# EAGLE design TPT02rr (EAGLE 7.5.0)
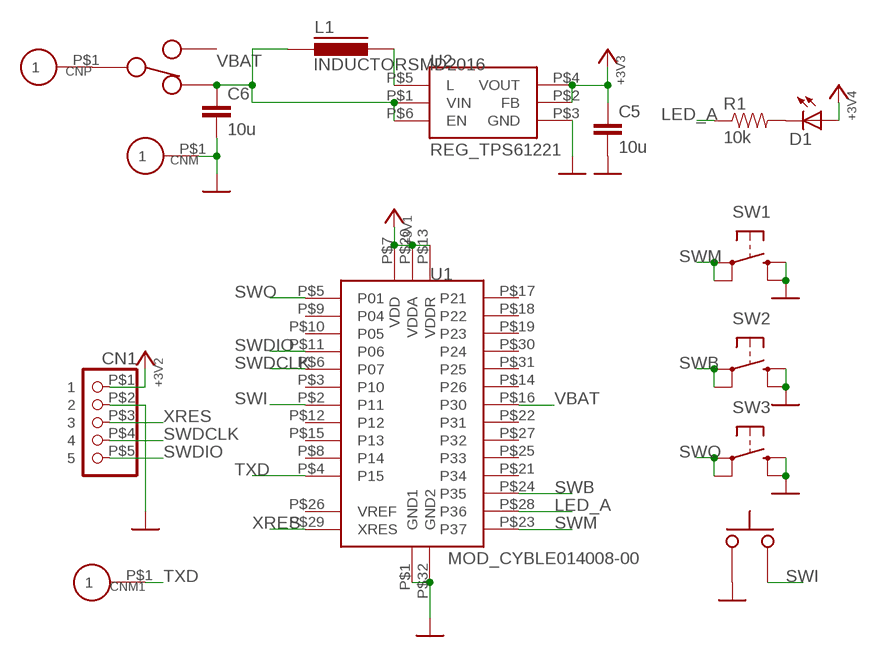
[diagram p0: schematic, sheet 1]

## Parts
C5  10u  CAP0603  [0603]
C6  10u  CAP0603  [0603]
CN1  CON_PINHD-1X550MIL  [1X5_50MIL]
CNM  CON_P01SMD1MM  [PAD_SMD1MM]
CNM1  CON_P01SMD1MM  [PAD_SMD1MM]
CNP  CON_P01SMD1MM  [PAD_SMD1MM]
D1  LED0603  [SPARKFUN_LED-0603]
L1  INDUCTORSMD2016  [2016]
R1  10k  RES0603  [0603]
SW1  SW_TACTEVQP2  [SW_EVQP2]
SW2  SW_TACTEVQPLBA08  [SW_EVQPLBA08]
SW3  SW_TACTEVQPLBA08  [SW_EVQPLBA08]
SW4  SW_SLIDECUS12B  [SW_CUS-12B]
SW5  SW_TACT2PB3U3000  [SW_B3U-3000P]
U1  MOD_CYBLE014008-00  [MOD_CYBLE014008-00]
U2  REG_TPS61221  [SC70-6]

## Nets
+3V3: C5.1 CN1.P$1 D1.A U1.P$7(VDD) U1.P$13(VDDR) U1.P$20(VDDA) U2.P$2(FB) U2.P$4(VOUT) ; supply symbol labelled POW_+3V3
GND: C5.2 C6.2 CN1.P$2 CNM.P$1 SW1.PB1(S) SW1.PB2(S1) SW2.B1(S) SW2.B2(S1) SW3.B1(S) SW3.B2(S1) SW5.P$2 U1.P$1(GND1) U1.P$32(GND2) U2.P$3(GND) ; supply symbol labelled POW_GND
LED_A: R1.1 U1.P$28(P36)
N$2: L1.P$2 U2.P$5(L)
N$7: D1.C R1.2
N$8: CNP.P$1 SW4.P$2
SWB: SW2.A1(P) SW2.A2(P1) U1.P$24(P35)
SWDCLK: CN1.P$4 U1.P$6(P07)
SWDIO: CN1.P$5 U1.P$11(P06)
SWI: SW5.P$1 U1.P$2(P11)
SWM: SW1.PA1(P) SW1.PA2(P1) U1.P$23(P37)
SWO: SW3.A1(P) SW3.A2(P1) U1.P$5(P01)
TXD: CNM1.P$1 U1.P$4(P15)
VBAT: C6.1 L1.P$1 SW4.P$1 U1.P$16(P30) U2.P$1(VIN) U2.P$6(EN)
XRES: CN1.P$3 U1.P$29(XRES)
Unconnected: U1.P$3(P10) U1.P$8(P14) U1.P$9(P04) U1.P$10(P05) U1.P$12(P12) U1.P$14(P26) U1.P$15(P13) U1.P$17(P21) U1.P$18(P22) U1.P$19(P23) U1.P$21(P34) U1.P$22(P31) U1.P$25(P33) U1.P$26(VREF) U1.P$27(P32) U1.P$30(P24) U1.P$31(P25)

## Power pins joined to a net without a drawn wire
P$3: SW4.P$3

## Library data of the parts
C5 C6 = akita:CAP: Capacitor Standard 0603 ceramic capacitor, and 0.1" leaded capacitor.
CN1 = akita:CON_PINHD-1X5: PIN HEADER
CNM CNM1 CNP = akita:CON_P01
D1 = akita:LED: LEDs Standard schematic elements and footprints for 5mm, 3mm, 1206, and 0603 sized LEDs. 5mm - Spark Fun Electronics SKU : COM-00529 (and others)
L1 = akita:INDUCTOR: Inductor
R1 = akita:RES: Resistor Basic schematic elements and footprints for 0603, 1206, and PTH resistors.
SW1-SW3 = akita:SW_TACT: OMRON SWITCH
SW4 = akita:SW_SLIDE
SW5 = akita:SW_TACT2P: OMRON SWITCH
U1 = akita:MOD_CYBLE014008-00: Cypress CYBLE014008-000
U2 = akita:REG_TPS61221: TI's TPS61220/1/2, boost DC/DC

## Board
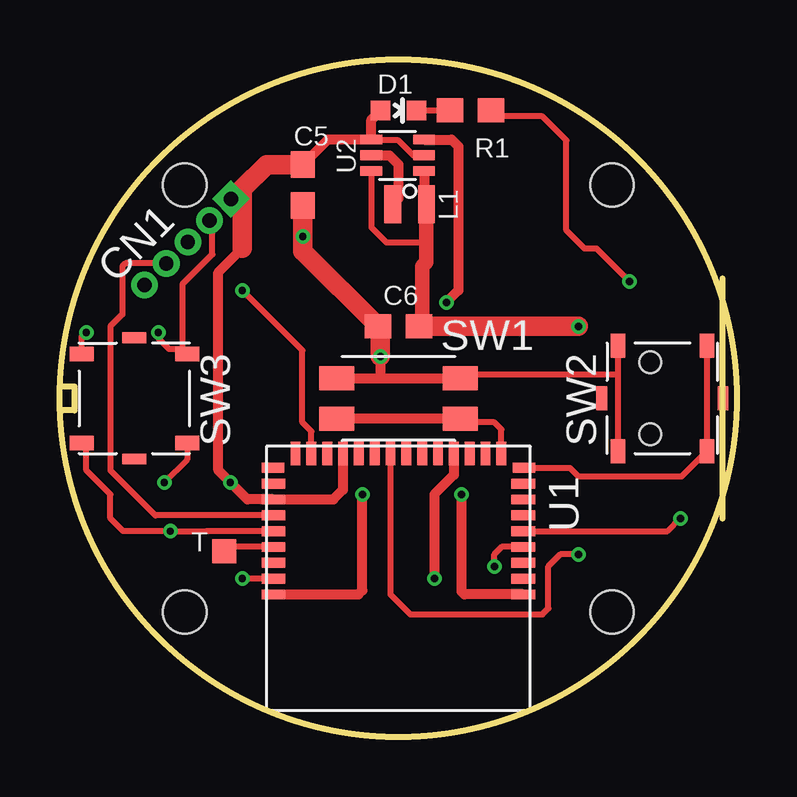
[diagram p1: board, top side]
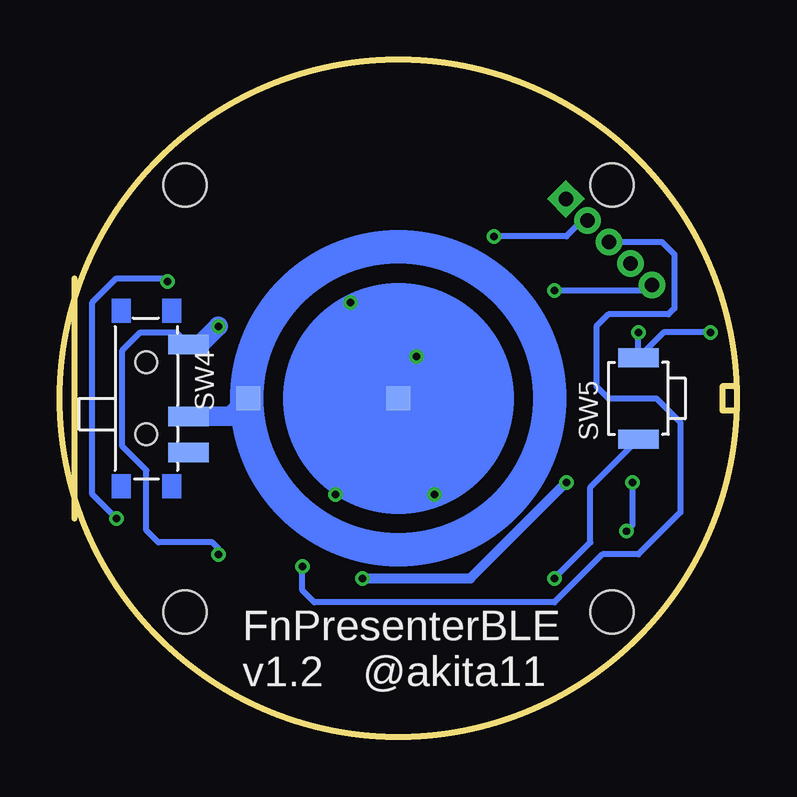
[diagram p2: board, bottom side, seen from below]

Size 28.2 x 28.2 mm. Coordinates in mm from the lower left corner, seen from the top.
Outline: 27.6,19.1 27.6,9.1
Outline: 0.1,14.6 0.6,14.6 0.6,13.6 0.1,13.6
Outline: circle at 14.1,14.1 radius 14.1
Copper layers (1*16): Top 0.035mm / dielectric 1.5mm / Bottom 0.035mm
Design rules "SeeedStudio_2layer_DRU_no_angle_20140221_Drill03mm": minimum track width 6mil, minimum drill 0.3mm, track to track 6mil, track to pad 6mil, pad to pad 6mil, via to via 6mil, smd to smd 0mil, copper to edge 10mil, drill to drill 10mil, minimum pad ring 10mil, minimum via ring 6mil, stop-mask expansion 2mil, vias tented up to drill 100mil, thermal gap 10mil
Holes 1.8 mm at 5.2,5.2 23,5.2 23,23 5.2,23

### Footprints (pad centres in the part's own frame; a part is rotated, then mirrored left to right if it is on the bottom)
0603 = smd 1.1 x 1: 1 -0.85,0; 2 0.85,0
1X5_50MIL = drill 0.6 square: P$1 0,2.54 | drill 0.6: P$2 0,1.27; P$3 0,0; P$4 0,-1.27; P$5 0,-2.54
PAD_SMD1MM = smd 1 x 1: P$1 0,0
SPARKFUN_LED-0603 = smd 0.8 x 0.8: A 0,-0.75; C 0,0.75
2016 = smd 0.7 x 1.6: P$1 -0.7,0; P$2 0.7,0
SW_EVQP2 = smd 1.45 x 1: PA1 -2.575,0.85; PA2 2.575,0.85; PB1 -2.575,-0.85; PB2 2.575,-0.85
SW_EVQPLBA08 = smd 0.6 x 1: A1 -1.85,2.2; A2 -1.85,-2.2; B1 1.85,2.2; B2 1.85,-2.2 | smd 0.45 x 1: G1 2.525,0; G2 -2.525,0
SW_CUS-12B = smd 0.813 x 1.676: P$1 -2.25,1.75; P$2 0.75,1.75; P$3 2.25,1.75 | hole 0.9: -1.5,0; 1.5,0
SW_B3U-3000P = smd 0.8 x 1.7: P$1 1.7,0; P$2 -1.7,0
MOD_CYBLE014008-00 = smd 0.99 x 0.41: P$1 5.205,0.67; P$2 5.205,0.01; P$3 5.205,-0.65; P$4 5.205,-1.31; P$5 5.205,-1.97; P$6 5.205,-2.63; P$7 5.205,-3.29; P$8 5.205,-3.95; P$25 -5.205,-3.95; P$26 -5.205,-3.29; P$27 -5.205,-2.63; P$28 -5.205,-1.97; P$29 -5.205,-1.31; P$30 -5.205,-0.65; P$31 -5.205,0.01; P$32 -5.205,0.67 | smd 0.94 x 0.41: P$9 5.23,-4.61; P$24 -5.23,-4.61 | smd 0.41 x 0.99: P$10 4.29,-5.205; P$11 3.63,-5.205; P$12 2.97,-5.205; P$13 2.31,-5.205; P$14 1.65,-5.205; P$15 0.99,-5.205; P$16 0.33,-5.205; P$17 -0.33,-5.205; P$18 -0.99,-5.205; P$19 -1.65,-5.205; P$20 -2.31,-5.205; P$21 -2.97,-5.205; P$22 -3.63,-5.205; P$23 -4.29,-5.205
SC70-6 = smd 0.4 x 0.9: P$1 -0.65,-1.1; P$2 0,-1.1; P$3 0.65,-1.1; P$4 0.65,1.1; P$5 0,1.1; P$6 -0.65,1.1

### Placement (x,y rotation side)
C5  10.12,22.99 270 top
C6  14.1,17.1 180 top
CN1  5.32,20.62 315 top
CNM  14.1,14.1 0 bottom
CNM1  6.85,7.72 0 top
CNP  20.35,14.1 0 bottom
D1  14.1,26.1 270 top
L1  14.57,22.19 180 top
R1  17.1,26.1 180 top
SW1  14.1,14.1 180 top
SW2  25.1,14.1 180 top
SW3  3.1,14.1 90 top
SW4  24.6,14.1 270 bottom
SW5  4.1,14.1 270 bottom
U1  14.1,6.6 180 top
U2  14.07,24.23 90 top

### Tracks (layer width: path | path; a pad name or v marks a point on that pad's centre or on a via)
+3V3  (via drill 0.3)
  Top 0.254: 7.6,21.98 7.56,21.98 CN1.P$1 | U2.P$2 14.72,24.23 14.1,24.85 13,24.85 U2.P$4
  Top 0.406: 7.6,20.35 6.6,19.35 6.6,11.1 v7.1,10.6 7.81,9.89 U1.P$7 11.39,9.89 11.79,10.29 U1.P$13 | U1.P$20 16.41,10.91 15.6,10.1 v15.6,6.6 | C5.1 11.16,24.88 U2.P$4 12.97,25.72 D1.A
  Top 0.813: 7.6,20.35 7.6,21.98 7.6,22.83 8.61,23.84 C5.1
  Bottom 0.406: v15.6,6.6 11.1,6.6 v7.1,10.6
GND  (via drill 0.3)
  Top 0.254: CN1.P$2 6.35,21.39 6.35,20.1 5.1,18.85 5.1,16.15 | 16.25,15.1 16.1,14.95 | 5.1,16.15 SW3.B2 | SW3.B1 0.9,16.65 v1.1,16.85 | 5.1,16.15 4.55,16.15 4.1,16.6 v4.1,16.85 | SW1.PB1 16.83,15.1 23.25,15.1 | SW2.B1 23.25,15.1 | 23.25,15.1 SW2.B2
  Top 0.406: SW1.PB2 13.35,14.95 | 13.35,14.95 16.1,14.95 SW1.PB1 16.77,14.85 | v13.35,15.85 13.35,14.95 | v16.73,10.1 16.73,6.05 16.85,5.93 U1.P$32 | U1.P$1 12.43,5.93 12.6,6.1 v12.6,10.1 | U2.P$3 16.32,24.88 16.6,24.6 16.6,18.6 v16.1,18.1
  Top 0.813: v13.35,15.85 13.35,17 C6.2 10.12,20.23 v10.12,20.85 C5.2
  Bottom 0.254: CN1.P$2 6.43,21.52 7.1,20.85 v10.12,20.85 | v1.1,16.85 3.05,16.85 SW5.P$2 v4.1,16.85
  Bottom 0.406: CNM.P$1 16.73,11.47 v16.73,10.1 | CNM.P$1 12.85,12.85 12.85,10.6 12.6,10.35 v12.6,10.1 | 14.1,15.1 CNM.P$1 | v16.1,18.1 15.6,18.1 v13.35,15.85
  Bottom 0.813: 14.1,15.1 v13.35,15.85
LED_A  (via drill 0.3)
  Top 0.254: R1.1 18.2,25.85 20.1,25.85 21.1,24.85 21.1,21.1 21.85,20.35 22.35,20.35 v23.73,18.98 | U1.P$28 25.32,8.57 v25.85,9.1
  Bottom 0.254: v25.85,9.1 26.85,10.1 26.85,18.1 25.85,19.1 23.85,19.1 v23.73,18.98
N$2
  Top 0.406: U2.P$5 13.72,24.23 14.1,23.85 14.1,22.42 L1.P$2
N$7
  Top 0.254: D1.C R1.2
N$8
  Bottom 0.813: SW4.P$2 21.1,13.35 CNP.P$1
SWB
  Top 0.254: SW2.A2 SW2.A1 25.9,10.85 21.6,10.85 21.24,11.21 U1.P$24
SWDCLK
  Top 0.254: CN1.P$4 2.72,19.72 2.6,19.6 2.6,17.6 2.1,17.1 2.1,11.1 3.97,9.23 U1.P$6
SWDIO  (via drill 0.3)
  Top 0.254: U1.P$11 10.47,12.73 10.1,13.1 10.1,16.1 v7.6,18.6
  Bottom 0.254: v7.6,18.6 3.75,18.6 CN1.P$5
SWI  (via drill 0.3)
  Top 0.254: v7.6,6.6 U1.P$2
  Bottom 0.254: v7.6,6.6 6.1,8.1 6.1,10.4 SW5.P$1
SWM
  Top 0.254: U1.P$23 18.39,12.81 18.1,13.1 16.83,13.1 SW1.PA1
  Top 0.406: SW1.PA1 SW1.PA2
SWO  (via drill 0.3)
  Top 0.254: U1.P$5 6.1,8.57 v4.6,8.57 2.63,8.57 2.1,9.1 2.1,10.1 1.1,11.1 1.1,12.05 SW3.A1 | SW3.A2 5.3,11.55 v4.35,10.6
  Bottom 0.254: v4.35,10.6 4.35,8.82 v4.6,8.57
TXD
  Top 0.254: U1.P$4 7.03,7.91 CNM1.P$1
VBAT  (via drill 0.3)
  Top 0.254: U1.P$16 13.77,5.93 14.6,5.1 20.1,5.1 20.35,5.35 20.35,7.1 20.85,7.6 v21.6,7.6 | U2.P$6 12.97,21.23 13.6,20.6 15.27,20.6
  Top 0.406: 16.5,17.25 16.35,17.1 | U2.P$1 15.17,22.29 L1.P$1
  Top 0.61: L1.P$1 15.27,20.6 15.27,19.77 15.1,19.6 15.1,17.25 C6.1
  Top 0.813: v21.6,17.1 16.35,17.1 C6.1
  Bottom 0.254: 21.48,17.23 v21.6,17.1 | v21.6,7.6 21.6,7.85 21.85,8.1 24.1,8.1 24.6,8.6 24.6,11.1 25.6,12.1 25.6,16.1 24.85,16.85 23.35,16.85 SW4.P$1
  Bottom 0.813: SW4.P$1 22.35,16.35 v21.6,17.1
XRES  (via drill 0.3)
  Top 0.254: v18.1,7.1 18.1,7.6 18.41,7.91 U1.P$29
  Bottom 0.254: CN1.P$3 3.12,20.62 2.6,20.1 2.6,17.85 2.85,17.6 5.35,17.6 5.85,17.1 5.85,14.6 5.35,14.1 3.35,14.1 2.35,13.1 2.35,9.35 4.1,7.6 5.6,7.6 7.6,5.6 17.6,5.6 18.1,6.1 v18.1,7.1
(copper drawn outside any net)
  shapes: Bottom circle x2

### Text on the board
tPlace: T
bPlace: @akita11 | FnPresenterBLE / v1.2
bNames: SW4
Document: t=0.6mm